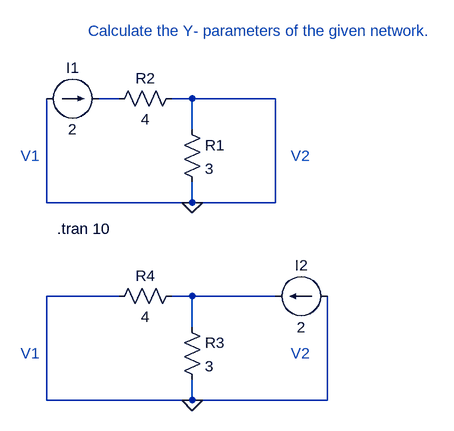
[diagram p0: schematic Lab6_ques5.asc]
Lab6_ques5.asc, the LTspice schematic file:
Version 4
SHEET 1 880 680
WIRE -32 160 -64 160
WIRE 80 160 48 160
WIRE 208 160 80 160
WIRE 80 208 80 160
WIRE -144 320 -144 160
WIRE 80 320 80 288
WIRE 80 320 -144 320
WIRE 208 320 208 160
WIRE 208 320 80 320
WIRE -32 464 -144 464
WIRE 80 464 48 464
WIRE 208 464 80 464
WIRE 80 512 80 464
WIRE -144 624 -144 464
WIRE 80 624 80 592
WIRE 80 624 -144 624
WIRE 288 624 288 464
WIRE 288 624 80 624
FLAG 80 320 0
FLAG 80 624 0
SYMBOL Res 64 192 R0
SYMATTR InstName R1
SYMATTR Value 3
SYMBOL Res 64 144 R90
WINDOW 0 0 56 VBottom 2
WINDOW 3 32 56 VTop 2
SYMATTR InstName R2
SYMATTR Value 4
SYMBOL current -144 160 R270
WINDOW 0 32 40 VTop 2
WINDOW 3 -32 40 VBottom 2
SYMATTR InstName I1
SYMATTR Value 2
SYMBOL Res 64 496 R0
SYMATTR InstName R3
SYMATTR Value 3
SYMBOL Res 64 448 R90
WINDOW 0 0 56 VBottom 2
WINDOW 3 32 56 VTop 2
SYMATTR InstName R4
SYMATTR Value 4
SYMBOL current 288 464 R90
WINDOW 0 -32 40 VBottom 2
WINDOW 3 32 40 VTop 2
SYMATTR InstName I2
SYMATTR Value 2
TEXT -80 56 Left 2 ;Calculate the Y- parameters of the given network.
TEXT 232 248 Left 2 ;V2
TEXT -184 248 Left 2 ;V1
TEXT -128 360 Left 2 !.tran 10
TEXT 232 552 Left 2 ;V2
TEXT -184 552 Left 2 ;V1

The netlist it stands for:
* Lab6_ques5.asc
R1 0 0 3
R2 0 N001 4
I1 0 N001 2
R3 N002 0 3
R4 N002 0 4
I2 0 N002 2
* Calculate the Y- parameters of the given network.
* V2
* V1
.tran 10
* V2
* V1
.backanno
.end